# Altium schematic sheet DS1338.schdoc
size 56 x 48 mm
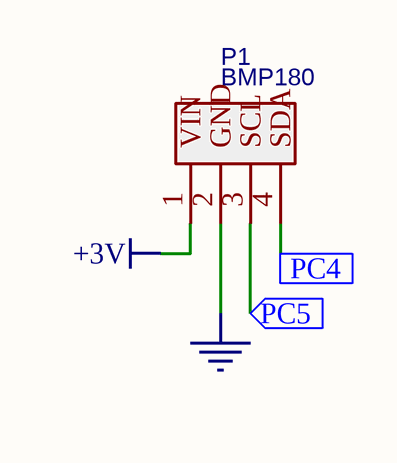
[diagram p0: DS1338.schdoc]

## Parts
P1  BMP180  [HDR-4X1/2.54]

## Ports
PC4 (in), PC5 (in)

## Nets
+3V: P1.1(VIN)
GND: P1.2(GND)
PC5: P1.3(SCL) ; port PC5

Not connected (* = marked no-connect by the designer): P1 4(SDA)

## Library data of the parts
P1 = BMP180: BOM_Manufacturer: ReliaPro; BOM_Manufacturer Part: Headers  Pins 1*4P; BOM_Supplier: LCSC; spicePre: P; BOM_Supplier Part: C59481